# EasyEDA Pro project 30.5PWMboard.eprj

# Schematic Schematic1
Create Date: 2024-01-17; Page Name: P1; Project Name: 30.5PWMboard; Schematic Name: Schematic1; Update Date: 2024-02-28; Company: 嘉立创EDA; Page Size: A4; Version: V1.0
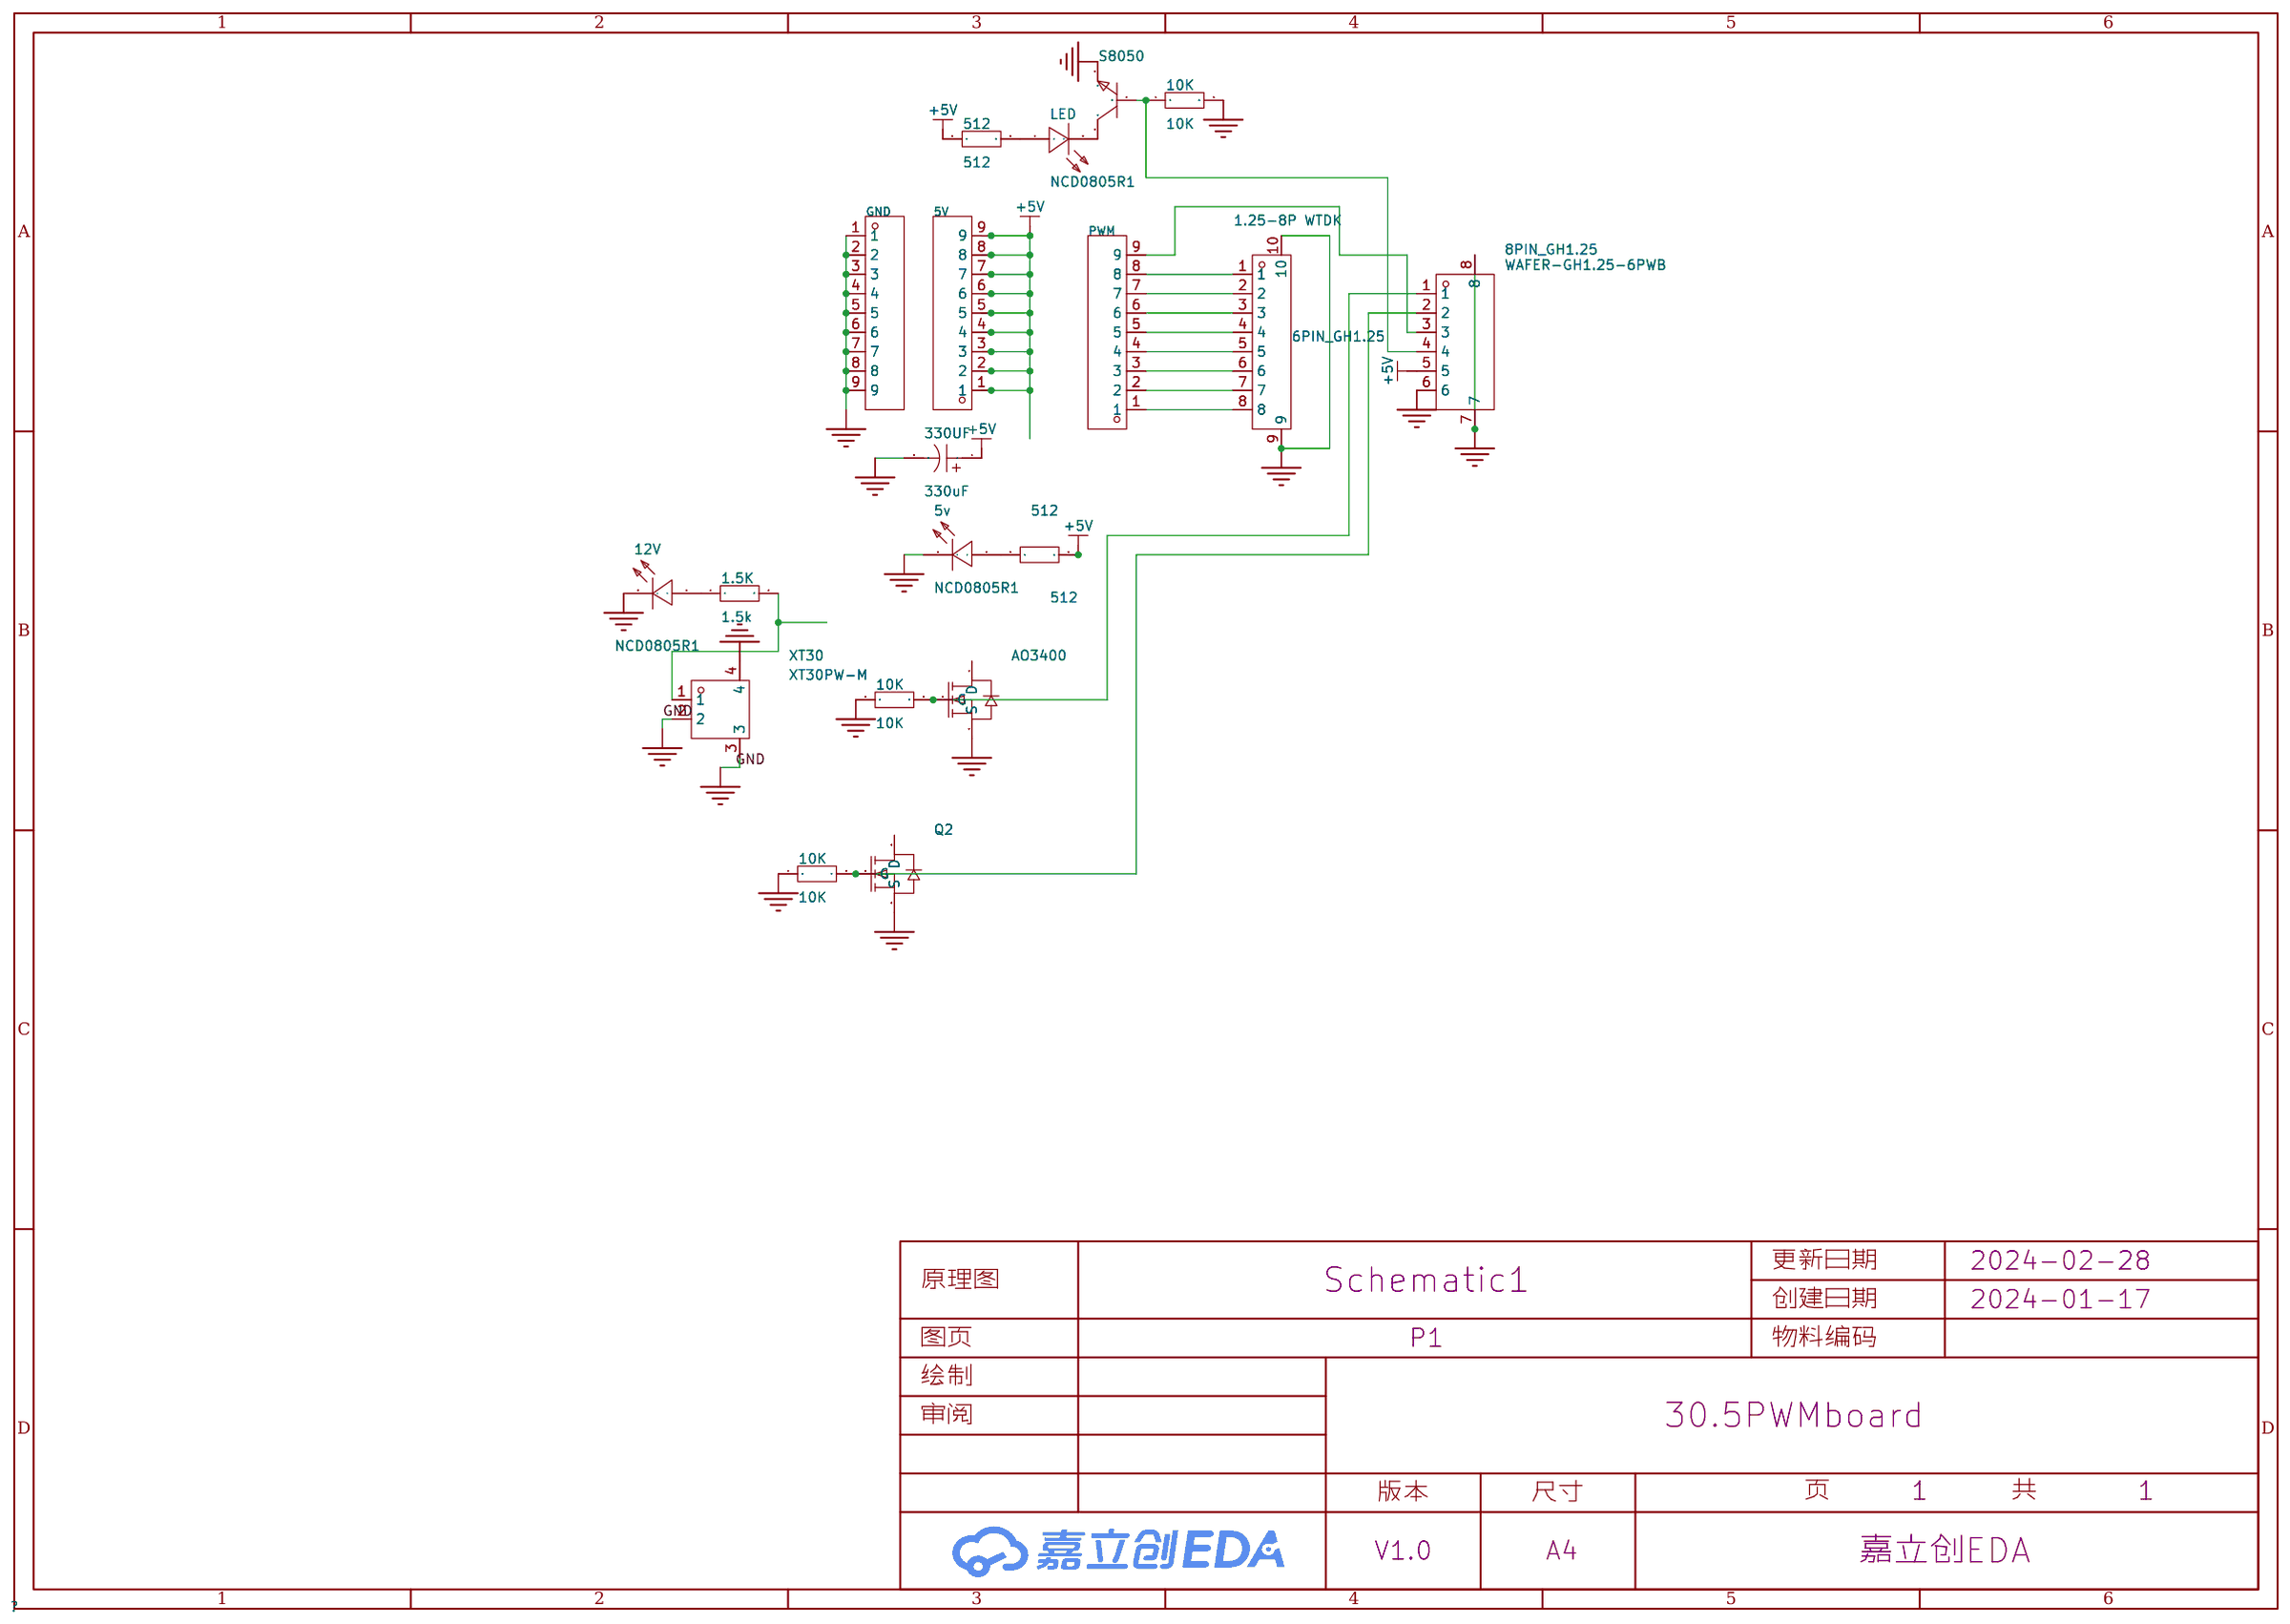
[diagram p0: schematic sheet]

## Parts
1.5K  1.5k  [R0603]
5v  NCD0805R1  [LED0805-R-RD]
5V  -  [HDR-TH_9P-P2.54-V-M]
6PIN_GH1.25  1.25-8P WTDK  [CONN-SMD_8P-P1.25_SHOU-HAN_1.25-8P-WTDK]
8PIN_GH1.25  WAFER-GH1.25-6PWB  [CONN-SMD_6P-P1.25_XUNPU_WAFER-GH1.25-6PWB]
10K  10K  [R0603]
10K#2  10K  [R0603]
10K#3  10K  [R0603]
12V  NCD0805R1  [LED0805-R-RD]
330UF  330uF  [CAP-SMD_BD6.3-L6.6-W6.6-LS7.2-FD]
512  512  [R0603]
512#2  512  [R0603]
AO3400  -  [SOT-23-3_L2.9-W1.3-P1.90-LS2.4-BR]
GND  -  [HDR-TH_9P-P2.54-V-M]
LED  NCD0805R1  [LED0805-R-RD]
PWM  -  [HDR-TH_9P-P2.54-V-M]
Q2  -  [SOT-23-3_L2.9-W1.3-P1.90-LS2.4-BR]
S8050  -  [S8050_SOT-23]
XT30  XT30PW-M  [CONN-TH_XT30PW-M]

## Library data of the parts
1.5K 10K 10K#2 10K#3 512 512#2 = Res_0603: Supplier Footprint: 0603
5v 12V LED = NCD0805R1: 灯头类型:-;发光颜色:红色;正向电压(VF):1.6V~2.6V;功率:65mW;正向电流:20mA;主波长:615nm~630nm;二极管配置:独立二极管;透镜颜色:无色透明;色温:-;发光强度:67mcd~195mcd;发光角度:130°;载带方式:-;工作温度:-30℃~+85℃;; Supplier Part: C84256; Manufacturer: 国星光电; Supplier Footprint: 0805; JLCPCB Part Class: 基础库; Datasheet: https://atta.szlcsc.com/upload/public/pdf/source/20200820/C84256_F0A75A43B3EAD75808600A0514C76B99.pdf; Supplier: LCSC; Emitted Color: 红色; Forward Voltage (VF): 1.6V~2.6V; Power Dissipation: 65mW; Forward Current: 20mA; Dominant Wavelength: 615nm~630nm; Diode Configuration: 独立二极管; Lens Color: 无色透明; Luminous Intensity: 67mcd~195mcd; Viewing Angle: 130°; Operating Temperature: -30℃~+85℃
5V GND PWM = HDR-M_2.54-1x9P: Supplier Part: C492408; Supplier Footprint: 插件
6PIN_GH1.25 = 1.25-8P WTDK: 插针结构:1x8P;间距:1.25mm;安装方式:卧贴;参考系列:GH;总PIN数:8P;排数:1;每排PIN数:8;额定电流:1A;工作温度范围:-25℃~+85℃;; LCSC Part Name: 间距:1.25mm 1x8P 卧贴; Supplier Part: C5340801; Manufacturer: SHOU HAN(首韩); Supplier Footprint: SMD,P=1.25mm,卧贴; JLCPCB Part Class: Extended Part; Datasheet: https://atta.szlcsc.com/upload/public/pdf/source/20221228/3C2730616DB3BDAC77F28C7666C8E841.pdf; Supplier: LCSC; Pins Structure: 1x8P; Pitch: 1.25mm; Mounting Style: 卧贴; Reference Series: GH; Number of Pins: 8P; Number of Rows: 1; Number of PINs Per Row: 8; Current Rating (Max): 1A; Operating Temperature Range: -25℃~+85℃
8PIN_GH1.25 = WAFER-GH1.25-6PWB: 插针结构:1x6P;间距:1.25mm;安装方式:卧贴;总PIN数:6P;排数:1;每排PIN数:6;参考系列:GH;额定电流:1A;工作温度范围:-25℃~+85℃;; LCSC Part Name: 1x6P 间距:1.25mm 卧贴 系列:GH 带扣; Supplier Part: C3029381; Manufacturer: XUNPU(讯普); Supplier Footprint: SMD,P=1.25mm; JLCPCB Part Class: Extended Part; Datasheet: https://atta.szlcsc.com/upload/public/pdf/source/20220527/CB8773BFB0913C3B8ABD62CB38BA101A.pdf; Supplier: LCSC; Pins Structure: 1x6P; Pitch: 1.25mm; Mounting Style: 卧贴; Number of Pins: 6P; Number of Rows: 1; Number of PINs Per Row: 6; Reference Series: GH; Current Rating (Max): 1A; Operating Temperature Range: -25℃~+85℃
330UF = RST330UF10V027: 容值:330uF;精度:±20%;额定电压:10V;纹波电流:190mA@120Hz;等效串联电阻:-;; LCSC Part Name: 330uF ±20% 10V; Supplier Part: C4747980; Manufacturer: KNSCHA(科尼盛); Supplier Footprint: SMD,D6.3xL7.7mm; JLCPCB Part Class: Extended Part; Datasheet: https://atta.szlcsc.com/upload/public/pdf/source/20220722/8FD5A8AB469AF15309F954C7263D6AEA.pdf; Supplier: LCSC; Tolerance: ±20%; Rated Voltage: 10V; Ripple Current: 190mA@120Hz; φD: 6.3mm; L: 7.7mm; Lifetime @ Temp: 2000hrs@105℃; Operating Temperature: -40℃~+105℃
AO3400 Q2 = AO3400A_N: 类型:N沟道;漏源电压(Vdss):30V;连续漏极电流(Id):5.2A;功率(Pd):1W;导通电阻(RDS(on)@Vgs,Id):35mΩ@10V,5A;阈值电压(Vgs(th)@Id):1.5V@250μA;; Supplier Footprint: SOT-23; Supplier Part: C700953
S8050 = S8050_SOT_NPN: Supplier Footprint: SOT-23
XT30 = XT30PW-M: 类别:-;类型1:-;; LCSC Part Name: AMASS(艾迈斯)航模插头 卧式弯脚 XT30PW-M公头; Supplier Part: C431092; Manufacturer: AMASS(艾迈斯); JLCPCB Part Class: Extended Part; Datasheet: https://atta.szlcsc.com/upload/public/pdf/source/20220222/6A9F22F7850E25B33E1BE430ADF8560B.pdf; Supplier: LCSC; Brand: 艾迈斯; Type: 航模插头; RatedVoltage: DC 500V; InterfaceType: 公头; RatedCurrent: 15A; RecommendedWireGauge: 16/18/20AWG; contact resistance: 1.2mΩ; specifications: 2pin

## Nets
+5V: 5V.1 5V.2 5V.3 5V.4 5V.5 5V.6 5V.7 5V.8 5V.9 8PIN_GH1.25.5 330UF.1 512.2 512#2.2
GND: 5v.2(-) 6PIN_GH1.25.9 6PIN_GH1.25.10 8PIN_GH1.25.6 8PIN_GH1.25.7 8PIN_GH1.25.8 10K.1 10K#2.1 10K#3.2 12V.2(-) 330UF.2 AO3400.2(S) GND.1 GND.2 GND.3 GND.4 GND.5 GND.6 GND.7 GND.8 GND.9 Q2.2(S) S8050.2 XT30.2 XT30.3 XT30.4
$1N694: 6PIN_GH1.25.1 PWM.8
$1N698: 6PIN_GH1.25.2 PWM.7
$1N702: 6PIN_GH1.25.3 PWM.6
$1N706: 6PIN_GH1.25.4 PWM.5
$1N935: 6PIN_GH1.25.6 PWM.3
$1N940: 6PIN_GH1.25.7 PWM.2
$1N949: 6PIN_GH1.25.8 PWM.1
$1N3717: 6PIN_GH1.25.5 PWM.4
$1N4665: 8PIN_GH1.25.3 PWM.9
$1N4758: 1.5K.1 12V.1(+)
$1N5400: LED.2(-) S8050.3
$1N5658: 1.5K.2 XT30.1
Net-(5v-1): 5v.1(+) 512.1
Net-(8PIN_GH1.25-1): 8PIN_GH1.25.1 10K.2 AO3400.1(G)
Net-(8PIN_GH1.25-2): 8PIN_GH1.25.2 10K#2.2 Q2.1(G)
Net-(8PIN_GH1.25-4): 8PIN_GH1.25.4 10K#3.1 S8050.1
Net-(512#2-1): 512#2.1 LED.1(+)

Not connected (* = marked no-connect by the designer): AO3400 3(D); Q2 3(D)

# Board PCB1
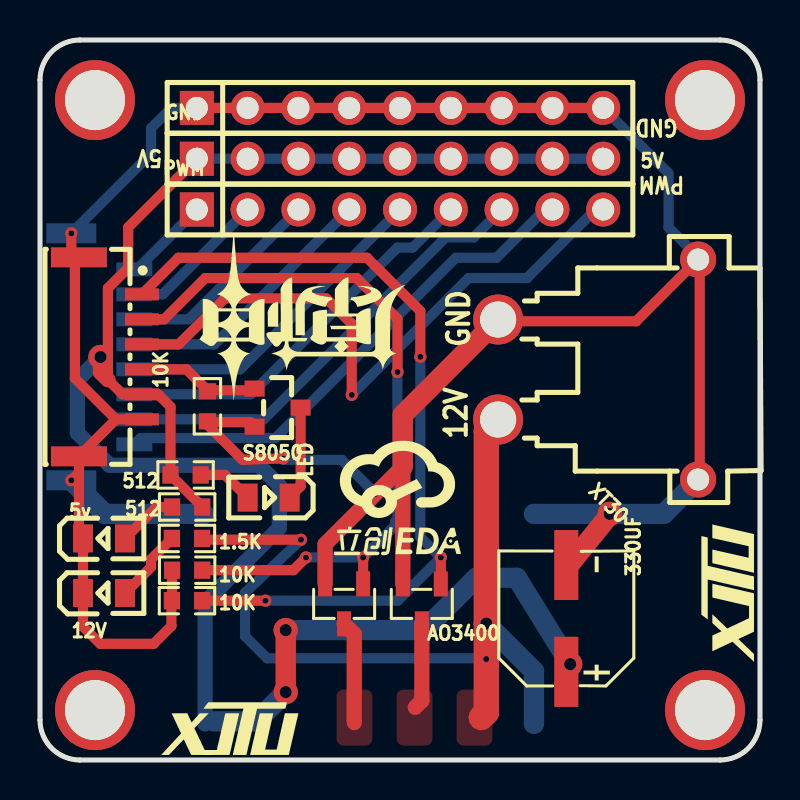
[diagram p1: board, top side]
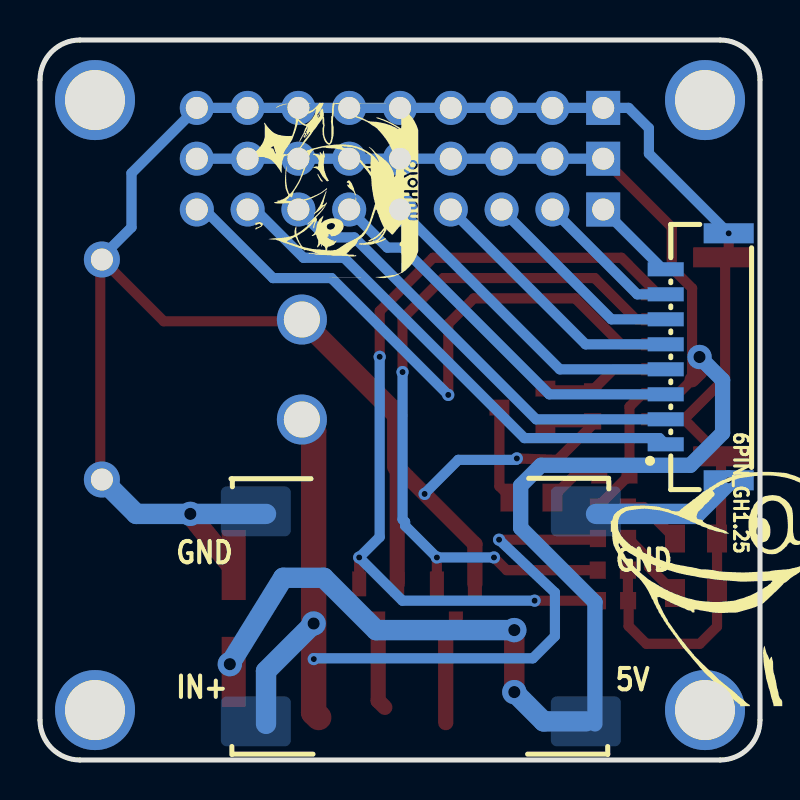
[diagram p2: board, bottom side, seen from below]

Outline 36 x 36 mm; copper layers: Top Layer, Bottom Layer. Coordinates in mm from the lower left corner of the outline.
Outline path: 0,34 0,2 arc(0.59,0.59) 2,0 34,0 arc(35.41,0.59) 36,2 36,34 arc(35.41,35.41) 34,36 2,36 arc(0.59,35.41) 0,34
Stack: Top Layer 0.035mm / Dielectric1 1.51mm FR4 er 4.5 / Bottom Layer 0.035mm

## Design rules (mm)
template: JLCPCB Capability(Two Layers Board)
spacing copperThickness1oz (default): track to track 0.102, other pairs 0.152 to 0.3
spacing copperThickness2oz: track to track 0.203, other pairs 0.152 to 0.3
track width copperThickness1oz (default): min 0.127, default 0.254, max 2.54
track width copperThickness2oz: min 0.203, default 0.254, max 2.54
differential pair differentialPair (default): width min 0.127, default 0.254, max 2.54; gap min 0.152, default 0.152
via viaSize (default): diameter min 0.5, default 0.61, max 10; hole min 0.3, default 0.305, max 6.3

## Placement (name value [footprint] x y rotation side)
1.5K  1.5k  [R0603]  7.35 11.08 0 top
5v  NCD0805R1  [LED0805-R-RD]  3.2 11.08 0 top
5V  -  [HDR-TH_9P-P2.54-V-M]  18 30.06 0 top
6PIN_GH1.25  1.25-8P WTDK  [CONN-SMD_8P-P1.25_SHOU-HAN_1.25-8P-WTDK]  3.14 20.16 90 bottom
8PIN_GH1.25  WAFER-GH1.25-6PWB  [CONN-SMD_6P-P1.25_XUNPU_WAFER-GH1.25-6PWB]  3.52 20.16 270 top
10K  10K  [R0603]  8.37 17.68 270 top
10K#2  10K  [R0603]  7.35 7.97 0 top
10K#3  10K  [R0603]  7.36 9.49 0 top
12V  NCD0805R1  [LED0805-R-RD]  3.2 8.35 0 top
330UF  330uF  [CAP-SMD_BD6.3-L6.6-W6.6-LS7.2-FD]  26.31 7.08 90 top
512  512  [R0603]  7.28 14.25 180 top
512#2  512  [R0603]  7.36 12.65 0 top
AO3400  -  [SOT-23-3_L2.9-W1.3-P1.90-LS2.4-BR]  19.09 7.81 90 top
GND  -  [HDR-TH_9P-P2.54-V-M]  18 32.6 0 top
LED  NCD0805R1  [LED0805-R-RD]  11.43 13.12 180 top
NOREF  -  [Pad_e24]  2.75 2.5 0 top
NOREF#2  -  [Pad_e23]  2.75 33 0 top
NOREF#3  -  [Pad_e12]  33.25 33 0 top
NOREF#4  -  [Pad_e25]  33.25 2.5 0 top
PWM  -  [HDR-TH_9P-P2.54-V-M]  18 27.52 0 top
Q2  -  [SOT-23-3_L2.9-W1.3-P1.90-LS2.4-BR]  15.21 7.81 90 top
S8050  -  [S8050_SOT-23]  11.88 17.75 180 top
XT30  XT30PW-M  [CONN-TH_XT30PW-M]  27.91 19.52 90 top

## Footprints (pads in the part's own frame, mm; a bottom-side part is the same pattern mirrored in y, then rotated)
CAP-SMD_BD6.3-L6.6-W6.6-LS7.2-FD
  rect 3.5x1.2 smd: 1(-2.67,0) 2(2.67,0)
CONN-SMD_6P-P1.25_XUNPU_WAFER-GH1.25-6PWB
  rect 0.6x1.7 smd: 1(-3.125,1.575) 2(-1.875,1.575) 3(-0.625,1.575) 4(0.625,1.575) 5(1.875,1.575) 6(3.125,1.575)
  rect 1x2.8 smd: 7(4.975,-1.575) 8(-4.975,-1.575)
CONN-SMD_8P-P1.25_SHOU-HAN_1.25-8P-WTDK
  rect 0.7x1.8 smd: 1(-4.375,1.575) 2(-3.125,1.575) 3(-1.875,1.575) 4(-0.625,1.575) 5(0.625,1.575) 6(1.875,1.575) 7(3.125,1.575) 8(4.375,1.575)
  rect 1x2.5 smd: 9(6.175,-1.575) 10(-6.175,-1.575)
CONN-TH_XT30PW-M
  round 2.5 hole 1.8: 1(-2.5,5) 2(2.5,5)
  round 1.8 hole 1.1: 3(5.5,-5) 4(-5.5,-5)
HDR-TH_9P-P2.54-V-M
  rect 1.7x1.7 hole 1.1: 1(-10.16,0)
  round 1.7 hole 1.1: 2(-7.62,0) 3(-5.08,0) 4(-2.54,0) 5(0,0) 6(2.54,0) 7(5.08,0) 8(7.62,0) 9(10.16,0)
LED0805-R-RD
  rect 1x1.399 smd: 1(1.05,0) 2(-1.05,0)
Pad_e12
  round 4 hole 3: 1(0,0)
Pad_e23
  round 4 hole 3: 2(0,0)
Pad_e24
  round 4 hole 3: 3(0,0)
Pad_e25
  round 4 hole 3: 4(0,0)
R0603
  rect 0.806x0.864 smd: 1(-0.753,0) 2(0.753,0)
S8050_SOT-23
  rect 1x0.8 smd: 1(1.15,-0.823) 2(1.15,1.077) 3(-1.15,0.127)
SOT-23-3_L2.9-W1.3-P1.90-LS2.4-BR
  rect 1.25x0.7 smd: 1(1,-0.95) 2(1,0.95) 3(-1,0)

## Nets
+5V: 5V.1 5V.2 5V.3 5V.4 5V.5 5V.6 5V.7 5V.8 5V.9 8PIN_GH1.25.5 330UF.1 512.2 512#2.2
GND: 5v.2 6PIN_GH1.25.9 6PIN_GH1.25.10 8PIN_GH1.25.6 8PIN_GH1.25.7 8PIN_GH1.25.8 10K.2 10K#2.1 10K#3.1 12V.2 330UF.2 AO3400.2 GND.1 GND.2 GND.3 GND.4 GND.5 GND.6 GND.7 GND.8 GND.9 Q2.2 S8050.2 XT30.2 XT30.3 XT30.4
LED1: AO3400.3
LED2: Q2.3
$1N694: 6PIN_GH1.25.1 PWM.8
$1N698: 6PIN_GH1.25.2 PWM.7
$1N702: 6PIN_GH1.25.3 PWM.6
$1N706: 6PIN_GH1.25.4 PWM.5
$1N854: 5v.1 512#2.1
$1N935: 6PIN_GH1.25.6 PWM.3
$1N940: 6PIN_GH1.25.7 PWM.2
$1N949: 6PIN_GH1.25.8 PWM.1
$1N3717: 6PIN_GH1.25.5 PWM.4
$1N4466: 8PIN_GH1.25.1 10K#2.2 AO3400.1
$1N4473: 8PIN_GH1.25.2 10K#3.2 Q2.1
$1N4665: 8PIN_GH1.25.3 PWM.9
$1N4758: 1.5K.1 12V.1
$1N5111: 512.1 LED.1
$1N5400: LED.2 S8050.3
$1N5434: 8PIN_GH1.25.4 10K.1 S8050.1
$1N5658: 1.5K.2 XT30.1

Pads without a net: NOREF 3; NOREF#2 2; NOREF#3 1; NOREF#4 4

## Via types
v1: diameter 1.219, hole 0.61, Top Layer to Bottom Layer, 6 vias
v2: diameter 0.61, hole 0.305, Top Layer to Bottom Layer, 13 vias

## Routing (per net, layer and track width the routed paths; a pad name or vN(x,y) marks a point on that pad's centre or on a via; arc(x,y) is an arc through that point)
+5V: length 42.6
  Top Layer w0.508: 5V.1 4.41,26.64 4.41,24.6 3.4,23.59 3.4,19.02 4.13,18.28 8PIN_GH1.25.5 5.91,18.28 6.53,17.66 512.2 8.11,12.67 512#2.2
  Bottom Layer w0.508: 5V.9 5V.8 5V.7 5V.6 5V.5 5V.4 5V.3 5V.2 5V.1
  vias: v1(3.02,20.15) v1(12.28,6.49) v1(12.28,3.39) v1(26.51,4.79)
GND: length 128.9
  Top Layer w0.508: 1.95,14.36 1.95,11.28 5v.2 12V.2 2.15,6.67 3.01,5.81 5.68,5.81 6.57,6.7 6.57,7.94 10K#2.1 6.6,7.98 10K#3.1 ; 1.95,14.36 8PIN_GH1.25.7 3.8,17.03 ; 1.95,14.36 v2(1.57,13.98) ; XT30.2 22.99,21.94 29.81,21.94 32.99,25.11 32.99,14.1 XT30.4 ; v2(1.57,26.33) 1.57,25.52 1.74,25.34 ; 3.8,17.03 8PIN_GH1.25.6 ; 3.8,17.03 1.74,19.09 1.74,25.34 ; 1.74,25.34 8PIN_GH1.25.8 ; GND.9 GND.8 GND.7 GND.6 GND.5 GND.4 GND.3 GND.2 GND.1
  Top Layer w0.762: 18.14,14.67 AO3400.2
  Top Layer w1.016: 18.14,14.67 18.14,17.26 XT30.2
  Bottom Layer w0.508: v2(1.57,26.33) 5.55,30.32 5.55,31.59 6.57,32.6 GND.1 GND.2 GND.3 GND.4 GND.5 GND.6 GND.7 GND.8 GND.9 31.43,29.34 31.43,26.63 32.91,25.15
  vias: v1(28.49,12.3) v2(12.16,15.08) v2(16.77,13.3)
LED1: length 4.3
  Top Layer w0.762: 18.76,2.63 19.09,2.96 AO3400.3
LED2: length 5.1
  Top Layer w0.762: 15.71,1.87 15.71,6.3 Q2.3
$1N694: length 25.8
  Bottom Layer w0.508: 6PIN_GH1.25.1 5.03,16.09 11.78,16.09 20.79,25.11 22.83,25.11 25.24,27.52 PWM.8
$1N698: length 22.7
  Bottom Layer w0.508: 6PIN_GH1.25.2 11.19,17.03 20.29,26.13 21.68,26.13 PWM.7
$1N702: length 19.7
  Bottom Layer w0.508: 6PIN_GH1.25.3 10.54,18.28 17.87,25.62 18.63,25.62 PWM.6
$1N706: length 16.6
  Bottom Layer w0.508: PWM.5 10.01,19.53 6PIN_GH1.25.4
$1N854: length 3
  Top Layer w0.508: 5v.1 5.82,12.65 512#2.1
$1N935: length 10.5
  Bottom Layer w0.508: 6PIN_GH1.25.6 7.43,22.03 PWM.3
$1N940: length 7.4
  Bottom Layer w0.508: 6PIN_GH1.25.7 6.14,23.28 PWM.2
$1N949: length 4.4
  Bottom Layer w0.508: PWM.1 4.85,24.53 6PIN_GH1.25.8
$1N3717: length 13.5
  Bottom Layer w0.508: PWM.4 8.72,20.78 6PIN_GH1.25.5
$1N4466: length 42.7
  Top Layer w0.508: 8PIN_GH1.25.1 6.93,25.11 16.35,25.11 19.02,22.45 v2(19.02,20.16) ; AO3400.1 v2(20.04,10.13) ; 8.1,7.97 v2(11.27,7.97)
  Bottom Layer w0.508: v2(11.27,7.97) 17.88,7.97 v2(20.04,10.13) 19.02,11.15 v2(19.02,20.16)
$1N4473: length 36.7
  Top Layer w0.508: v2(17.87,19.4) 17.87,22.06 15.84,24.1 8.26,24.1 6.2,22.03 8PIN_GH1.25.2 ; v2(13.3,10.13) 12.67,9.49 10K#3.2 ; Q2.1 v2(16.16,10.13)
  Bottom Layer w0.508: v2(17.87,19.4) 17.87,12.03 17.75,11.9 17.75,11.72 v2(16.16,10.13) v2(13.3,10.13)
$1N4665: length 31.6
  Top Layer w0.508: 8PIN_GH1.25.3 6.94,20.78 9.24,23.08 14.32,23.08 15.59,21.81 v2(15.59,18.25)
  Bottom Layer w0.508: 15.65,18.32 21.43,24.1 24.35,24.1 27.91,27.65
$1N4758: length 3.7
  Top Layer w0.508: 1.5K.1 5.55,10.04 5.55,9.65 12V.1
$1N5658: length 45
  Top Layer w0.508: 8.1,11.08 8.16,11.02 v2(13.05,11.02) ; 22.06,2.13 22.19,2
  Top Layer w1.27: 22.06,2.13 22.32,2.38 v1(22.32,6.82) 22.32,16.44 XT30.1
  Bottom Layer w0.508: 22.32,5.09 11.36,5.09 10.25,6.19 10.25,8.37 v2(13.05,11.02)
  Bottom Layer w1.016: v1(22.32,6.82) 24.7,4.44 24.7,1.81
  vias: v2(22.31,5.05)
$1N5111: length 2.8
  Top Layer w0.508: 512.1 9.25,14.25 LED.1
$1N5400: length 4.7
  Top Layer w0.508: S8050.3 13.03,13.69 12.47,13.13
$1N5434: length 6.1
  Top Layer w0.508: 5.1,19.53 7.32,19.53 8.37,18.48 10.65,18.48 S8050.1

## Copper pours and planes (outline as drawn; the poured copper is in the pictures)
+5V on Bottom Layer: 6.96,3.18 10.46,3.18 10.46,0.68 6.96,0.68
GND on Bottom Layer: 6.96,13.68 10.46,13.68 10.46,11.18 6.96,11.18
GND on Bottom Layer: 23.46,13.68 26.96,13.68 26.96,11.18 23.46,11.18
LED1 on Top Layer: 17.82,3.52 19.62,3.52 19.62,0.72 17.82,0.72
LED2 on Top Layer: 14.82,3.52 16.62,3.52 16.62,0.72 14.82,0.72
$1N5658 on Top Layer: 20.82,3.52 22.62,3.52 22.62,0.72 20.82,0.72
$1N5658 on Bottom Layer: 23.46,3.18 26.96,3.18 26.96,0.68 23.46,0.68

## Text on the board
Bottom Silkscreen Layer: GND | 5V | IN+
Top Silkscreen Layer: GND | PWM | 5V | 12V
